# Altium schematic sheet Top.SchDoc: Sensor Module - Top
size A4; CompanyName: UofT Capstone Team 2024991; Revision: 1; SheetNumber: 1; SheetTotal: 3
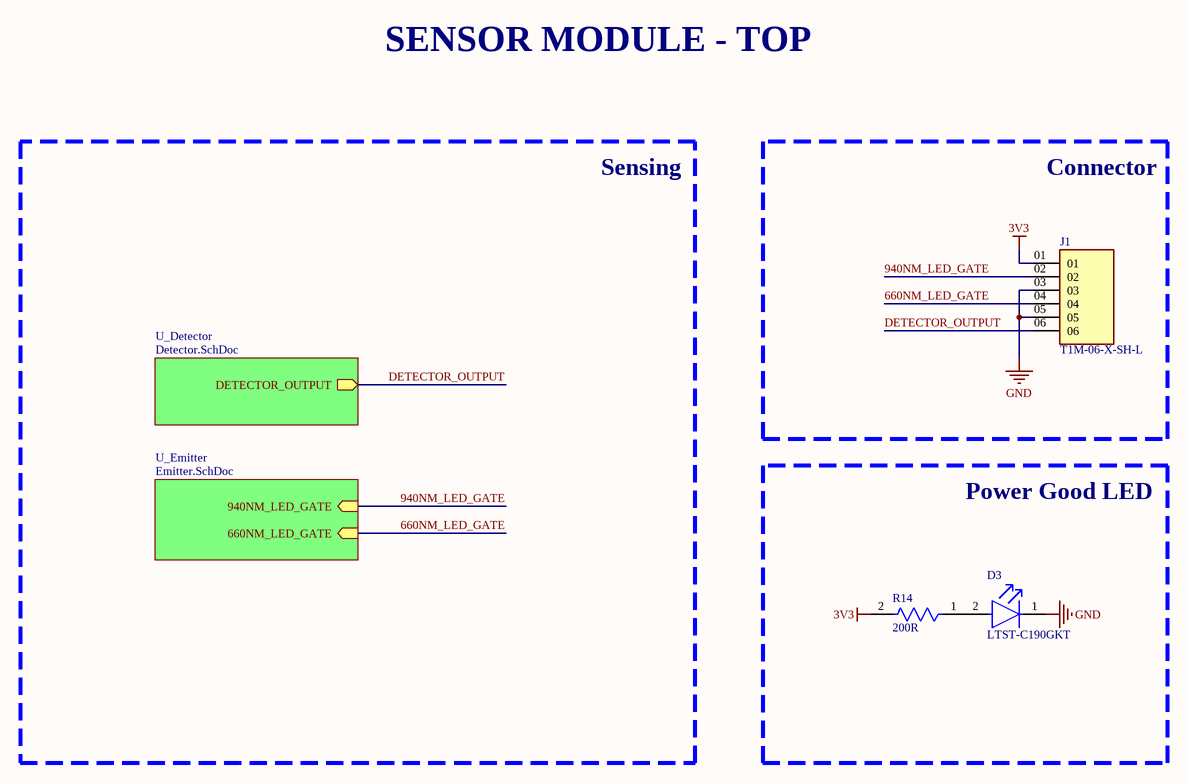
[diagram p0: Top.SchDoc]

## Parts
D3  LTST-C190GKT  [FP-LTST-C190GKT-MFG]
J1  T1M-06-X-SH-L  [SAMTEC_T1M-06-X-SH-L]
R14  Resistance: 200R  [FP-CRCW0603-e3-MFG]  (hidden comment: CRCW0603200RFKEA)

## Blocks framed on the sheet
Connector: J1
Power Good LED: D3 R14

## Sub-sheets
U_Detector = Detector.SchDoc: DETECTOR_OUTPUT (out)
U_Emitter = Emitter.SchDoc: 940NM_LED_GATE (in), 660NM_LED_GATE (in)

## Nets
3V3: J1.01 R14.2
GND: D3.1(C) J1.03 J1.05
660NM_LED_GATE: J1.04 ; sheet U_Emitter/660NM_LED_GATE
940NM_LED_GATE: J1.02 ; sheet U_Emitter/940NM_LED_GATE
DETECTOR_OUTPUT: J1.06 ; sheet U_Detector/DETECTOR_OUTPUT
NetD3_2: D3.2(A) R14.1

## Notes on the sheet
- SENSOR MODULE - TOP
- Sensing

## Library data of the parts
D3 = CMP-22017-000005-2: LED GREEN CLEAR CHIP SMD; Dominant Wavelength: 569nm; Reverse Voltage: 5V; Lens Color: Colorless; Viewing Angle: 130°; Voltage: 2V; Forward Current: 30mA; Power Dissipation: 100mW; Luminous Intensity: 6mcd; Number of LEDs: 1; Forward Voltage: 2.1V; Wavelength: 565nm; Test Current: 10mA; Min Operating Temperature: -55°C; Lens Style: Clear; Mount: Surface Mount; Width: 0.8mm; Packaging: Tape and Reel; Lens Transparency: Clear; Case Code (Metric): 1608; Depth: 0.8mm; Case Code (Imperial): 0603; Case/Package: 0603; Number of Pins: 2; Max Operating Temperature: 85°C; Lead Free: Lead Free; Number of Elements: 1; Length: 1.6mm; Height: 0.8mm; Package Quantity: 1; Power Rating: 100mW; Radiation Hardening: No; Illumination Color: Green; Color: Green
J1 = T1M-06-X-SH-L: Connector Header Surface Mount, Right Angle 6 position 0.039" (1.00mm); MF: Samtec; Availability: Unavailable; Value: *; Price: None; MP: T1M-06-X-SH-L; Package: None
R14 = CMP-2000-03062-2: RES Thick Film, 200Ω, 1%, 0.1W, 100ppm/°C, 0603; Power Rating: 100mW; Voltage Rating (DC): 75V; Military Standard: Not; Tolerance: 1%; Lead Free: Lead Free; Case Code (Imperial): 0603; Depth: 0.85mm; Max Operating Temperature: 155°C; Contact Plating: Tin; Length: 1.55mm; Weight: 7.1E-05oz; Voltage Rating: 75V; Height: 0.45mm; Min Operating Temperature: -55°C; Case/Package: 0603; Number of Pins: 2; Composition: Thick Film; Termination: SMD/SMT; Case Code (Metric): 1608; Width: 0.85mm; Package Quantity: 5000; Temperature Coefficient: 100ppm/°C; Packaging: Tape and Reel